# Altium schematic sheet Switch_Matrix_32_2.schdoc: Switch Matrix 32:2
size 420 x 297 mm; EDA_Number: ARTIQ; Projet: Switch Matrix 32:2 top; Author: G.Kasprowicz; CompanyName: WUT ISE; DrawnBy: G.Kasprowicz; Organization: WUT ISE; Address1: PW ISE; Address2: Nowowiejska 15/19 00-665 Warsaw; Address3: gkasprow@gmail.com; DocumentNumber: 1; Revision: 2; SheetNumber: 1; SheetTotal: 6; ModifiedBy: -; CheckedDate: -; Title2: Top; DivGrp: WUT ISE; Designer: G.Kasprowicz; ModifiedDate: -; ProjectName: Sensor Box
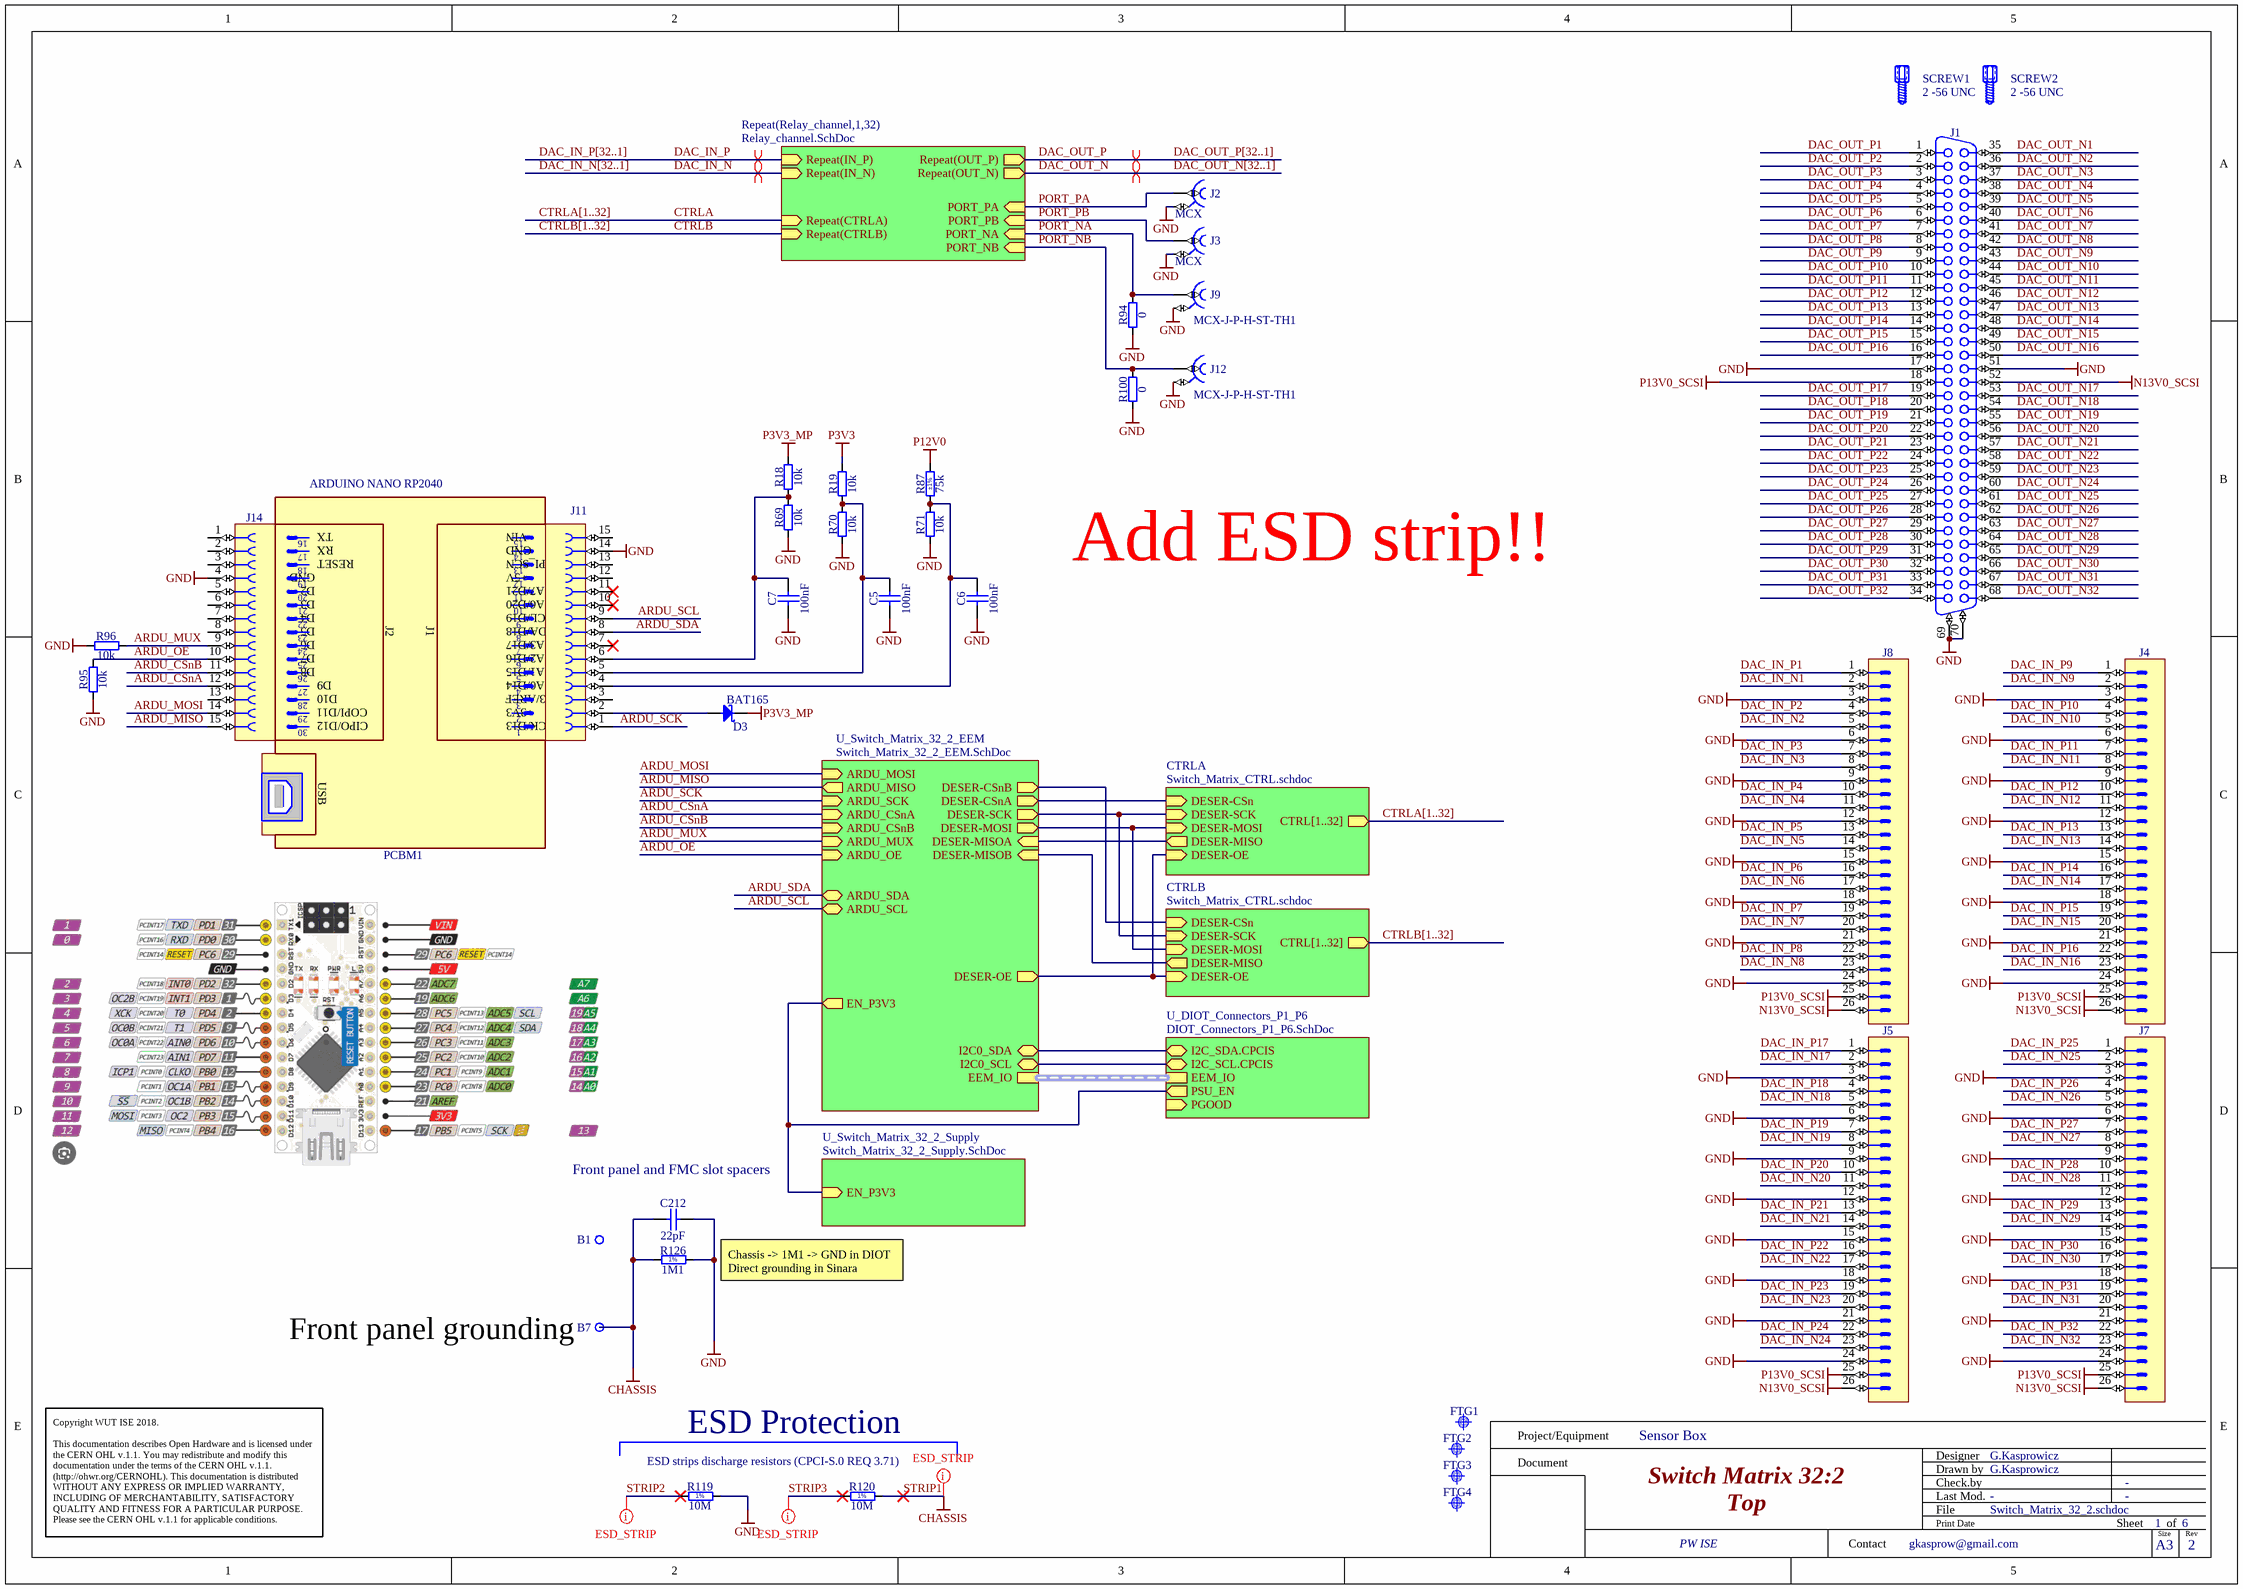
[diagram p0: Switch_Matrix_32_2.schdoc]

## Parts
B1  Plated Hole  [MTG270_500]  (value not drawn)
B7  Plated Hole  [MTG270_500]  (value not drawn)
C5  100nF  [CAPC1608X87N]
C6  100nF  [CAPC1608X87N]
C7  100nF  [CAPC1608X87N]
C212  22pF  [CAPC1005X55N]
D3  BAT165  [SOD2512X110N]
FTG1  Use only in PCB  [FIDUCIAL_TOP_C100-200]  (value not drawn)
FTG2  Use only in PCB  [FIDUCIAL_TOP_S100-200]  (value not drawn)
FTG3  Use only in PCB  [FIDUCIAL_TOP_S100-200]  (value not drawn)
FTG4  Use only in PCB  [FIDUCIAL_TOP_S100-200]  (value not drawn)
J1  D-SUB  [TYCO_5787082-7]  (value not drawn)
J2  MCX  [AMPHENOL_919-383J-51A]
J3  MCX  [AMPHENOL_919-383J-51A]
J4  Header 26  [3M_N2526-6002RB]  (value not drawn)
J5  Header 26  [3M_N2526-6002RB]  (value not drawn)
J7  Header 26  [3M_N2526-6002RB]  (value not drawn)
J8  Header 26  [3M_N2526-6002RB]  (value not drawn)
J9  Manufacturer Part Number: MCX-J-P-H-ST-TH1  [SAMTEC_MCX-J-P-H-ST-TH1]  (hidden comment: Coax_1Female_1Shield)
J11  Socket 15  [SAMTEC_SSW-115-01-X-S]  (value not drawn)
J12  Manufacturer Part Number: MCX-J-P-H-ST-TH1  [SAMTEC_MCX-J-P-H-ST-TH1]  (hidden comment: Coax_1Female_1Shield)
J14  Socket 15  [SAMTEC_SSW-115-01-X-S]  (value not drawn)
PCBM1  ARDUINO NANO RP2040  [PCBM_ARDUINO NANO RP2040]
R18  10k  [RESC1608X55N]
R19  10k  [RESC1608X55N]
R69  10k  [RESC1608X55N]
R70  10k  [RESC1608X55N]
R71  10k  [RESC1608X55N]
R87  75k  Tolerance: ±1%  [RESC1608X55N]
R94  0  [RESC1608X55N]
R95  10k  [RESC1608X55N]
R96  10k  [RESC1608X55N]
R100  0  [RESC1608X55N]
R119  10M  [RESC2113X55N]
R120  10M  [RESC2113X55N]
R126  1M1  [RESC2012X60N]
SCREW1  2 -56 UNC  [TYCO_786585-2]
SCREW2  2 -56 UNC  [TYCO_786585-2]

## Sub-sheets
CTRLA = Switch_Matrix_CTRL.schdoc: DESER-CSn (in), DESER-SCK (in), DESER-MOSI (in), DESER-MISO (out), CTRL[1..32] (out), DESER-OE (in)
CTRLB = Switch_Matrix_CTRL.schdoc: DESER-CSn (in), DESER-SCK (in), DESER-MOSI (in), DESER-MISO (out), CTRL[1..32] (out), DESER-OE (in)
Repeat(Relay_channel,1,32) = Relay_channel.SchDoc: Repeat(OUT_P) (out), Repeat(OUT_N) (out), Repeat(CTRLA) (in), Repeat(IN_P) (in), Repeat(IN_N) (in), PORT_PA (in), PORT_PB (in), PORT_NA (in), PORT_NB (in), Repeat(CTRLB) (in)
U_DIOT_Connectors_P1_P6 = DIOT_Connectors_P1_P6.SchDoc: I2C_SDA.CPCIS (bidir), I2C_SCL.CPCIS (bidir), EEM_IO (harness EEM_LVDS), PSU_EN (out), PGOOD (in)
U_Switch_Matrix_32_2_EEM = Switch_Matrix_32_2_EEM.SchDoc: DESER-CSnA (out), DESER-SCK (out), DESER-MOSI (out), DESER-CSnB (out), ARDU_MOSI (in), ARDU_MISO (out), ARDU_SCK (in), ARDU_CSnA (in), ARDU_CSnB (in), ARDU_MUX (in), DESER-MISOA (in), DESER-MISOB (in), I2C0_SDA (bidir), I2C0_SCL (bidir), DESER-OE (out), ARDU_OE (in), EEM_IO (harness EEM_LVDS), EN_P3V3 (out), ARDU_SDA (bidir), ARDU_SCL (bidir)
U_Switch_Matrix_32_2_Supply = Switch_Matrix_32_2_Supply.SchDoc: EN_P3V3 (in)

## Nets
GND: C5.1 C6.1 C7.1 C212.2 J1.17 J1.51 J1.69 J1.70 J2.2 J3.2 J4.3 J4.6 J4.9 J4.12 J4.15 J4.18 J4.21 J4.24 J5.3 J5.6 J5.9 J5.12 J5.15 J5.18 J5.21 J5.24 J7.3 J7.6 J7.9 J7.12 J7.15 J7.18 J7.21 J7.24 J8.3 J8.6 J8.9 J8.12 J8.15 J8.18 J8.21 J8.24 J9.2 J11.14 J12.2 J14.4 R69.1 R70.1 R71.1 R94.1 R95.1 R96.1 R100.1 R119.2 R126.2
N13V0_SCSI: J1.52 J4.26 J5.26 J7.26 J8.26
P3V3: R19.2
P3V3_MP: D3.1(C) R18.2
P12V0: R87.2
P13V0_SCSI: J1.18 J4.25 J5.25 J7.25 J8.25
STRIP1: B7.1 C212.1 R120.2 R126.1  [also labelled CHASSIS]
ARDU_CSnA: J14.12 ; sheet U_Switch_Matrix_32_2_EEM/ARDU_CSnA
ARDU_CSnB: J14.11 ; sheet U_Switch_Matrix_32_2_EEM/ARDU_CSnB
ARDU_MISO: J14.15 ; sheet U_Switch_Matrix_32_2_EEM/ARDU_MISO
ARDU_MOSI: J14.14 ; sheet U_Switch_Matrix_32_2_EEM/ARDU_MOSI
ARDU_MUX: J14.9 R96.2 ; sheet U_Switch_Matrix_32_2_EEM/ARDU_MUX
ARDU_OE: J14.10 R95.2 ; sheet U_Switch_Matrix_32_2_EEM/ARDU_OE
ARDU_SCK: J11.1 ; sheet U_Switch_Matrix_32_2_EEM/ARDU_SCK
ARDU_SCL: J11.9 ; sheet U_Switch_Matrix_32_2_EEM/ARDU_SCL
ARDU_SDA: J11.8 ; sheet U_Switch_Matrix_32_2_EEM/ARDU_SDA
CTRLA: sheet Repeat(Relay_channel,1,32)/Repeat(CTRLA)
CTRLB: sheet Repeat(Relay_channel,1,32)/Repeat(CTRLB)
DAC_IN_N: sheet Repeat(Relay_channel,1,32)/Repeat(IN_N)
DAC_IN_N1: J8.2
DAC_IN_N2: J8.5
DAC_IN_N3: J8.8
DAC_IN_N4: J8.11
DAC_IN_N5: J8.14
DAC_IN_N6: J8.17
DAC_IN_N7: J8.20
DAC_IN_N8: J8.23
DAC_IN_N9: J4.2
DAC_IN_N10: J4.5
DAC_IN_N11: J4.8
DAC_IN_N12: J4.11
DAC_IN_N13: J4.14
DAC_IN_N14: J4.17
DAC_IN_N15: J4.20
DAC_IN_N16: J4.23
DAC_IN_N17: J5.2
DAC_IN_N18: J5.5
DAC_IN_N19: J5.8
DAC_IN_N20: J5.11
DAC_IN_N21: J5.14
DAC_IN_N22: J5.17
DAC_IN_N23: J5.20
DAC_IN_N24: J5.23
DAC_IN_N25: J7.2
DAC_IN_N26: J7.5
DAC_IN_N27: J7.8
DAC_IN_N28: J7.11
DAC_IN_N29: J7.14
DAC_IN_N30: J7.17
DAC_IN_N31: J7.20
DAC_IN_N32: J7.23
DAC_IN_P: sheet Repeat(Relay_channel,1,32)/Repeat(IN_P)
DAC_IN_P1: J8.1
DAC_IN_P2: J8.4
DAC_IN_P3: J8.7
DAC_IN_P4: J8.10
DAC_IN_P5: J8.13
DAC_IN_P6: J8.16
DAC_IN_P7: J8.19
DAC_IN_P8: J8.22
DAC_IN_P9: J4.1
DAC_IN_P10: J4.4
DAC_IN_P11: J4.7
DAC_IN_P12: J4.10
DAC_IN_P13: J4.13
DAC_IN_P14: J4.16
DAC_IN_P15: J4.19
DAC_IN_P16: J4.22
DAC_IN_P17: J5.1
DAC_IN_P18: J5.4
DAC_IN_P19: J5.7
DAC_IN_P20: J5.10
DAC_IN_P21: J5.13
DAC_IN_P22: J5.16
DAC_IN_P23: J5.19
DAC_IN_P24: J5.22
DAC_IN_P25: J7.1
DAC_IN_P26: J7.4
DAC_IN_P27: J7.7
DAC_IN_P28: J7.10
DAC_IN_P29: J7.13
DAC_IN_P30: J7.16
DAC_IN_P31: J7.19
DAC_IN_P32: J7.22
DAC_OUT_N: sheet Repeat(Relay_channel,1,32)/Repeat(OUT_N)
DAC_OUT_N1: J1.35
DAC_OUT_N2: J1.36
DAC_OUT_N3: J1.37
DAC_OUT_N4: J1.38
DAC_OUT_N5: J1.39
DAC_OUT_N6: J1.40
DAC_OUT_N7: J1.41
DAC_OUT_N8: J1.42
DAC_OUT_N9: J1.43
DAC_OUT_N10: J1.44
DAC_OUT_N11: J1.45
DAC_OUT_N12: J1.46
DAC_OUT_N13: J1.47
DAC_OUT_N14: J1.48
DAC_OUT_N15: J1.49
DAC_OUT_N16: J1.50
DAC_OUT_N17: J1.53
DAC_OUT_N18: J1.54
DAC_OUT_N19: J1.55
DAC_OUT_N20: J1.56
DAC_OUT_N21: J1.57
DAC_OUT_N22: J1.58
DAC_OUT_N23: J1.59
DAC_OUT_N24: J1.60
DAC_OUT_N25: J1.61
DAC_OUT_N26: J1.62
DAC_OUT_N27: J1.63
DAC_OUT_N28: J1.64
DAC_OUT_N29: J1.65
DAC_OUT_N30: J1.66
DAC_OUT_N31: J1.67
DAC_OUT_N32: J1.68
DAC_OUT_P: sheet Repeat(Relay_channel,1,32)/Repeat(OUT_P)
DAC_OUT_P1: J1.1
DAC_OUT_P2: J1.2
DAC_OUT_P3: J1.3
DAC_OUT_P4: J1.4
DAC_OUT_P5: J1.5
DAC_OUT_P6: J1.6
DAC_OUT_P7: J1.7
DAC_OUT_P8: J1.8
DAC_OUT_P9: J1.9
DAC_OUT_P10: J1.10
DAC_OUT_P11: J1.11
DAC_OUT_P12: J1.12
DAC_OUT_P13: J1.13
DAC_OUT_P14: J1.14
DAC_OUT_P15: J1.15
DAC_OUT_P16: J1.16
DAC_OUT_P17: J1.19
DAC_OUT_P18: J1.20
DAC_OUT_P19: J1.21
DAC_OUT_P20: J1.22
DAC_OUT_P21: J1.23
DAC_OUT_P22: J1.24
DAC_OUT_P23: J1.25
DAC_OUT_P24: J1.26
DAC_OUT_P25: J1.27
DAC_OUT_P26: J1.28
DAC_OUT_P27: J1.29
DAC_OUT_P28: J1.30
DAC_OUT_P29: J1.31
DAC_OUT_P30: J1.32
DAC_OUT_P31: J1.33
DAC_OUT_P32: J1.34
PORT_NA: J9.1 R94.2 ; sheet Repeat(Relay_channel,1,32)/PORT_NA
PORT_NB: J12.1 R100.2 ; sheet Repeat(Relay_channel,1,32)/PORT_NB
PORT_PA: J2.1 ; sheet Repeat(Relay_channel,1,32)/PORT_PA
PORT_PB: J3.1 ; sheet Repeat(Relay_channel,1,32)/PORT_PB
STRIP2: R119.1
STRIP3: R120.1
NetC5_2: C5.2 J11.5 R19.1 R70.2
NetC6_2: C6.2 J11.4 R71.2 R87.1
NetC7_2: C7.2 J11.6 R18.1 R69.2
NetD3_2: D3.2(A) J11.2
(unnamed): sheet U_Switch_Matrix_32_2_EEM/DESER-CSnA, sheet CTRLA/DESER-CSn
(unnamed): sheet U_Switch_Matrix_32_2_EEM/DESER-SCK, sheet CTRLA/DESER-SCK, sheet CTRLB/DESER-SCK
(unnamed): sheet U_Switch_Matrix_32_2_EEM/DESER-MOSI, sheet CTRLA/DESER-MOSI, sheet CTRLB/DESER-MOSI
(unnamed): sheet U_Switch_Matrix_32_2_EEM/DESER-CSnB, sheet CTRLB/DESER-CSn
(unnamed): sheet U_Switch_Matrix_32_2_EEM/DESER-MISOA, sheet CTRLA/DESER-MISO
(unnamed): sheet U_Switch_Matrix_32_2_EEM/DESER-MISOB, sheet CTRLB/DESER-MISO
(unnamed): sheet U_Switch_Matrix_32_2_EEM/I2C0_SDA, sheet U_DIOT_Connectors_P1_P6/I2C_SDA.CPCIS
(unnamed): sheet U_Switch_Matrix_32_2_EEM/I2C0_SCL, sheet U_DIOT_Connectors_P1_P6/I2C_SCL.CPCIS
(unnamed): sheet U_Switch_Matrix_32_2_EEM/DESER-OE, sheet CTRLA/DESER-OE, sheet CTRLB/DESER-OE
(unnamed): sheet U_Switch_Matrix_32_2_EEM/EN_P3V3, sheet U_Switch_Matrix_32_2_Supply/EN_P3V3, sheet U_DIOT_Connectors_P1_P6/PSU_EN

Not connected (* = marked no-connect by the designer): B1 1; J11 3 7* 10* 11* 12 13 15; J14 1 2 3 5 6 7 8 13

## Buses and harness runs
bus CTRLA[1..32]
bus CTRLA[1..32] = sheet CTRLA/CTRL[1..32]
bus CTRLB[1..32]
bus CTRLB[1..32] = sheet CTRLB/CTRL[1..32]
bus DAC_IN_N[32..1]
bus DAC_IN_P[32..1]
bus DAC_OUT_N[32..1]
bus DAC_OUT_P[32..1]
harness sheet U_DIOT_Connectors_P1_P6/EEM_IO = sheet U_Switch_Matrix_32_2_EEM/EEM_IO

## Layout directives
differential pair: DAC_IN_N, DAC_IN_P, DAC_OUT_N, DAC_OUT_P
net class ESD_STRIP: STRIP1, STRIP2, STRIP3

## Notes on the sheet
- Add ESD strip!!
- Front panel and FMC slot spacers
- (near B7) Front panel grounding
- Chassis -> 1M1 -> GND in DIOT
  Direct grounding in Sinara
- ESD strips discharge resistors (CPCI-S.0 REQ 3.71)
- ESD Protection
- Project/Equipment
- Document
- Designer
- Drawn by
- Check.by
- Copyright WUT ISE 2018.
  This documentation describes Open Hardware and is licensed under the CERN OHL v.1.1. You may redistribute and modify this documentation under the terms of the CERN OHL v.1.1. (http://ohwr.org/CERNOHL). This documentation is distributed WITHOUT ANY EXPRESS OR IMPLIED WARRANTY, INCLUDING OF MERCHANTABILITY, SATISFACTORY QUALITY AND FITNESS FOR A PARTICULAR PURPOSE. Please see the CERN OHL v.1.1 for applicable conditions.
- Contact
- File
- Last Mod.
- Print Date
- Sheet
- Size
- A3
- of
- Rev
- (in symbol PCBM_ARDUINO NANO RP2040) TX; VIN; 16; 15; RX; GND; 17; 14; RESET; QSPI_SCN; 18; 13; +5V; 19; 12; D2; A7/D21; 20; 11; D3; A6/D20; 21; 10; D4; A5/SCL/D19; 22; 9; D5; J2; J1; A4/SDA/D18; 23; 8; D6; A3/D17; 24; 7; D7; A2/D16; 25; 6; D8; A1/D15; 26; 5; D9; A0/D14; 27; 4; D10; PA03/AREF; 28; 3; COPI/D11; +3V3; 29; 2; CIPO/D12; SCK/D13; 30; 1; USB
- (in symbol R0805_1M1_1%_0.125W_100PPM) 1%
- (in symbol R0805_10M_1%_0.125W_100PPM_VISHAY_CRCW e3) 1%

## Library data of the parts
B1 B7 = PLATED_HOLE2.7_PAD5.0: Single Terminal Socket; Part Description: Plated Through Hole: Hole Dia.=2.7mm Pad Dia.=5.0mm; Mounted: No; Part Number: PLATED_HOLE2.7_PAD5.0; Component Kind: Standard (No BOM); Component Type: Standard (No BOM); Pin Count: 1; Family: Plated Hole; Socket: No; SMD: No; Sense: No; Status: None; ComponentHeight: 0mm; HelpURL: Undefined; Author: CERN DEM JMW; CreateDate: 27.09.2011; LatestRevisionDate: 27.09.2011; PackageDescription: Plated Through Hole: Hole Dia.=2.7mm Pad Dia.=5.0mm
C5-C7 = CC0603_100NF_50V_10%_X7R: Non-polarised capacitor; Part Description: SMD Multilayer Chip Ceramic Capacitor; Manufacturer: GENERIC; Manufacturer1 Part Number: 223858615649; Voltage: 50V; TC: X7R; Tolerance: ±10%; Part Number: CC0603_100NF_50V_10%_X7R; Component Kind: Standard; Component Type: Standard; Pin Count: 2; Value: 100nF; Status: Preferred; Manufacturer Part Number: CC0603_100NF_50V_10%_X7R; Case: 0603; Mounted: Yes; Socket: No; SMD: Yes; Sense: No; Manufacturer1 Example: PHYCOMP; Manufacturer1 ComponentHeight: 0.87mm; HelpURL: \\cern.ch\dfs\Applications\Altium\Datasheets\CC0603_X7R_PHYCOMP.pdf; Author: CERN DEM JLC; CreateDate: 03.12.2007; LatestRevisionDate: 03.12.2007
C212 = CC0402_22PF_50V_5%_C0G: Non-polarised capacitor; Part Description: SMD Multilayer Chip Ceramic Capacitor; Manufacturer: GENERIC; Manufacturer1 Part Number: C0402C220J5GACTU; Voltage: 50V; TC: C0G/NP0; Tolerance: ±5%; Part Number: CC0402_22PF_50V_5%_C0G; Component Kind: Standard; Component Type: Standard; Pin Count: 2; Value: 22pF; Status: Preferred; Manufacturer Part Number: CC0402_22PF_50V_5%_C0G; Case: 0402; Mounted: Yes; Socket: No; SMD: Yes; Manufacturer1 Example: KEMET; Manufacturer1 ComponentHeight: 0.55mm; HelpURL: \\cern.ch\dfs\Applications\Altium\Datasheets\CC0402_C0G_KEMET_(Commercial Grade).pdf; Author: CERN DEM JLC; CreateDate: 2007-12-03; LatestRevisionDate: 2007-12-03; Sense: No
D3 = BAT165: Schottky Diode; Part Description: Medium Power AF Schottky Diode; Manufacturer: INFINEON; Voltage: 40V; Power: 750mA; PressFit: No; Bonding: No; Part Number: BAT165; Component Kind: Standard; Component Type: Standard; Device: BAT165; PackageDescription: Small Outline Diode (SOD-323), 1.70mm W X 1.25mm L X 1.10mm H body,  IPC Medium Density; Manufacturer Part Number: BAT165; Pin Count: 2; Case: SOD-323; Mounted: Yes; Socket: No; SMD: Yes; Sense: No; ComponentHeight: 1.1mm; HelpURL: \\cern.ch\dfs\Applications\Altium\Datasheets\BAT165.pdf; Author: CERN DEM JLC; CreateDate: 12.11.2014; LatestRevisionDate: 12.11.2014
FTG1 = FIDUCIAL_TARGET_C100-200: Fiducial Target; Part Description: Round Fiducial Target, Top Layer, 1.0mm, Top Solder 2.0mm, Keepout =2.0mm; Mounted: No; Part Number: FIDUCIAL_TARGET_C100-200; Component Kind: Standard (No BOM); Component Type: Standard (No BOM); Pin Count: 1; Family: Fiducial; Socket: No; SMD: Yes; Sense: No; Status: None; ComponentHeight: 0mm; HelpURL: Undefined; Author: CERN DEM JLC; CreateDate: 09.02.2010; LatestRevisionDate: 04.04.2012; PackageDescription: Round Fiducial Target, Top Layer, 1.0mm, Top Solder 2.0mm, Keepout =2.0mm
FTG2-FTG4 = FIDUCIAL_TARGET_S100-200: Fiducial Target; Part Description: Square Fiducial Target, Top Layer, 1.0mm, Top Solder 2.0mm, Keepout =2.0mm; Mounted: No; Part Number: FIDUCIAL_TARGET_S100-200; Component Kind: Standard (No BOM); Component Type: Standard (No BOM); Pin Count: 1; Family: Fiducial; Socket: No; SMD: Yes; Sense: No; Status: None; ComponentHeight: 0mm; HelpURL: Undefined; Author: CERN DEM JLC; CreateDate: 09.02.2010; LatestRevisionDate: 04.04.2012; PackageDescription: Square Fiducial Target, Top Layer, 1.0mm, Top Solder 2.0mm, Keepout =2.0mm
J1 = TYCO_5787082-7: 68 contacts, AMPLIMITE .050", Right Angled Receptacle Series III; Manufacturer: TYCO ELECTRONICS; PressFit: No; Part Number: TYCO_5787082-7; Component Kind: Standard; Component Type: Standard; Pin Count: 70; Family: D-SUB; Mounted: Yes; Socket: No; SMD: No; Sense: No; Status: None; Part Description: 68 contacts, AMPLIMITE .050", Right Angled Receptacle Series III; Manufacturer Part Number: 5787082-7; ComponentHeight: 9.5mm; HelpURL: \\cern.ch\dfs\Applications\Altium\Datasheets\TYCO_5787082-7.pdf; Author: CERN DEM JLC; CreateDate: 13.03.2017; LatestRevisionDate: 13.03.2017
J2 J3 = AMPHENOL_919-383J-51A: Part Description: 50 Ohm, RF Connector, MCX Right Angle PCB Receptacle Jack; PressFit: No; Part Number: AMPHENOL_919-383J-51A; Component Kind: Standard; Component Type: Standard; Pin Count: 5; Family: MCX; Mounted: Yes; Socket: No; SMD: No; Sense: No; Status: None; Manufacturer: AMPHENOL; Manufacturer Part Number: 919-383J-51A; ComponentHeight: 6mm; HelpURL: \\cern.ch\dfs\Applications\Altium\Datasheets\AMPHENOL_919-383J-51A.pdf; Author: CERN DEM BC; CreateDate: 31.01.2019; LatestRevisionDate: 31.01.2019
J4 J5 J7 J8 = 3M_N2526-6002RB: Connector 26 Male; Part Description: 26 Contacts - Straight .100'' x .100'' Low Profile Four-Wall Header, 2500 Series; Manufacturer: 3M; PressFit: No; Part Number: 3M_N2526-6002RB; Component Kind: Standard; Component Type: Standard; Pin Count: 26; Family: Header 26; Mounted: Yes; Socket: No; SMD: No; Sense: No; Status: None; Manufacturer Part Number: N2526-6002RB; ComponentHeight: 10.03mm; HelpURL: \\cern.ch\dfs\Applications\Altium\Datasheets\3M_N2526-6002RB.pdf; Author: CERN DEM JLC; CreateDate: 11.02.2009; LatestRevisionDate: 11.08.2009
J9 J12 = SAMTEC_MCX-J-P-H-ST-TH1: Part Description: Straight Through-hole 50 Ohms Mini Jack, MCX Series; Manufacturer: SAMTEC; PressFit: No; Part Number: SAMTEC_MCX-J-P-H-ST-TH1; Component Kind: Standard; Component Type: Standard; Pin Count: 2; Mounted: Yes; Socket: No; SMD: No; Sense: No; Status: None; ComponentHeight: 5.81mm; HelpURL: \\cern.ch\dfs\Applications\Altium\Datasheets\SAMTEC_MCX-J-P-H-ST-TH1.pdf; Author: CERN DEM BC; CreateDate: 09.09.2020; LatestRevisionDate: 09.09.2020
J11 J14 = SAMTEC_SSW-115-01-T-S: Connector 15 Female; Part Description: 15 Contacts, Pitch 2.54mm, Single Row Through Mount Straight Socket (Lead Length 2.64mm); Manufacturer: SAMTEC; PressFit: No; Part Number: SAMTEC_SSW-115-01-T-S; Component Kind: Standard; Component Type: Standard; Pin Count: 15; Family: Socket 15; Mounted: Yes; Socket: No; SMD: No; Sense: No; Status: None; Manufacturer Part Number: SSW-115-01-T-S; ComponentHeight: 8.51mm; HelpURL: \\cern.ch\dfs\Applications\Altium\Datasheets\SAMTEC_SSW.pdf; Author: CERN DEM HF; CreateDate: 08.08.2023; LatestRevisionDate: 08.08.2023
PCBM1 = PCBM_ARDUINO NANO RP2040: Arduino NANO Printed Circuit Board Module; Part Description: Arduino NANO RP2040 Printed Circuit Board Module; PressFit: No; Bonding: No; Part Number: PCBM_ARDUINO NANO RP2040; Component Kind: Accessories; Component Type: Standard; Device: ARDUINO NANO RP2040; PackageDescription: Microcontroller Board Arduino NANO RP2040; Manufacturer: ARDUINO; Manufacturer Part Number: ARDUINO NANO RP2040; Pin Count: 0; Mounted: Yes; Socket: No; SMD: No; Sense: No; ComponentHeight: 15.4mm; Author: CERN DEM HF; HelpURL: \\cern.ch\dfs\Applications\Altium\Datasheets\PCBM_ARDUINO NANO RP2040.pdf; CreateDate: 06.09.2022; LatestRevisionDate: 06.09.2022
R18 R19 R69-R71 R95 R96 = R0603_10K_1%_0.1W_100PPM: Resistor - 1%; Part Description: General Purpose Thick Film Chip Resistor; Manufacturer: GENERIC; Manufacturer1 Part Number: NRC06F1002TRF; Power: 0.1W; TC: ±100ppm/°C; PressFit: No; Part Number: R0603_10K_1%_0.1W_100PPM; Component Kind: Standard; Component Type: Standard; Pin Count: 2; Value: 10k; Status: Preferred; Tolerance: ±1%; Manufacturer Part Number: R0603_10K_1%_0.1W_100PPM; Case: 0603; Mounted: Yes; Sense: No; Socket: No; SMD: Yes; Manufacturer1 Example: NIC COMPONENT; Manufacturer1 ComponentHeight: 0.55mm; HelpURL: \\cern.ch\dfs\Applications\Altium\Datasheets\R0603_NIC_NRC.pdf; Author: CERN DEM JLC; CreateDate: 03.12.2007; LatestRevisionDate: 13.03.2008
R87 = R0603_75K_1%_0.1W_100PPM: Resistor - 1%; Part Description: General Purpose Thick Film Chip Resistor; Manufacturer: GENERIC; Manufacturer1 Part Number: NRC06F7502TRF; Power: 0.1W; TC: ±100ppm/°C; PressFit: No; Part Number: R0603_75K_1%_0.1W_100PPM; Component Kind: Standard; Component Type: Standard; Pin Count: 2; Value: 75k; Status: Preferred; Manufacturer Part Number: R0603_75K_1%_0.1W_100PPM; Case: 0603; Mounted: Yes; Sense: No; Socket: No; SMD: Yes; Manufacturer1 Example: NIC COMPONENT; Manufacturer1 ComponentHeight: 0.55mm; HelpURL: \\cern.ch\dfs\Applications\Altium\Datasheets\R0603_NIC_NRC.pdf; Author: CERN DEM JLC; CreateDate: 03.12.2007; LatestRevisionDate: 13.03.2008
R94 R100 = R0603_0R_JUMPER: Resistor; Part Description: 1A (0.05R Max DC Resistance) Zero Ohm Jumper; Manufacturer: GENERIC; Manufacturer1 Part Number: NRC06Z0; PressFit: No; Part Number: R0603_0R_JUMPER; Component Kind: Standard; Component Type: Standard; Pin Count: 2; Value: 0; Status: Preferred; Manufacturer Part Number: R0603_0R_JUMPER; Case: 0603; Mounted: Yes; Sense: No; Socket: No; SMD: Yes; Manufacturer1 Example: NIC COMPONENT; Manufacturer1 ComponentHeight: 0.55mm; HelpURL: \\cern.ch\dfs\Applications\Altium\Datasheets\R0603_NIC_NRC.pdf; Author: CERN DEM JLC; CreateDate: 03.12.2007; LatestRevisionDate: 13.03.2008
R119 R120 = R0805_10M_1%_0.125W_100PPM_VISHAY_CRCW e3: Resistor - 1%; Part Description: 150V, Standard Thick Film Chip Resistor; Manufacturer: VISHAY DALE; Manufacturer Part Number: CRCW080510M0FKEA; Power: 0.125W; TC: ±100ppm/°C; PressFit: No; Part Number: R0805_10M_1%_0.125W_100PPM_VISHAY_CRCW e3; Component Kind: Standard; Component Type: Standard; Pin Count: 2; Value: 10M; Status: None; Tolerance: ±1%; Case: 0805; Mounted: Yes; Sense: No; Socket: No; SMD: Yes; ComponentHeight: 0.5mm; HelpURL: \\cern.ch\dfs\Applications\Altium\Datasheets\R0805_VISHAY_CRCW e3.pdf; Author: CERN DEM BC; CreateDate: 2019-11-12; LatestRevisionDate: 2019-11-12
R126 = R0805_1M1_1%_0.125W_100PPM: Resistor - 1%; Part Description: General Purpose Thick Film Chip Resistor; Manufacturer: GENERIC; Manufacturer1 Part Number: NRC10F1104TRF; PressFit: No; Part Number: R0805_1M1_1%_0.125W_100PPM; Component Kind: Standard; Component Type: Standard; Pin Count: 2; Value: 1M1; Status: Preferred; Manufacturer Part Number: R0805_1M1_1%_0.125W_100PPM; Case: 0805; Mounted: Yes; Sense: No; Socket: No; SMD: Yes; Manufacturer1 Example: NIC COMPONENT; Manufacturer1 ComponentHeight: 0.6mm; HelpURL: \\cern.ch\dfs\Applications\Altium\Datasheets\R0805_NIC_NRC.pdf; Author: CERN DEM JLC; CreateDate: 03/12/2007; LatestRevisionDate: 13/03/2008
SCREW1 SCREW2 = MECH_Tyco_SCSI_Screwlock: SCSI Screw Lock; Part Description: 50SR SCREWLOCK KIT, FEMALE; Manufacturer: TYCO ELECTRONICS; Manufacturer Part Number: 786585-2; PressFit: No; Part Number: TYCO_786585-2; Component Kind: Standard; Component Type: Mechanical; Pin Count: 0; PackageDescription: 50SR SCREWLOCK KIT, FEMALE; Mounted: Yes; Socket: No; SMD: No; Sense: No; Status: None; Value: 2 -56 UNC; ComponentHeight: 9.02mm; Author: GK; CreateDate: 10.09.2013; LatestRevisionDate: 10.09.2013